# Altium schematic sheet OneKey_Download.SchDoc
size A4
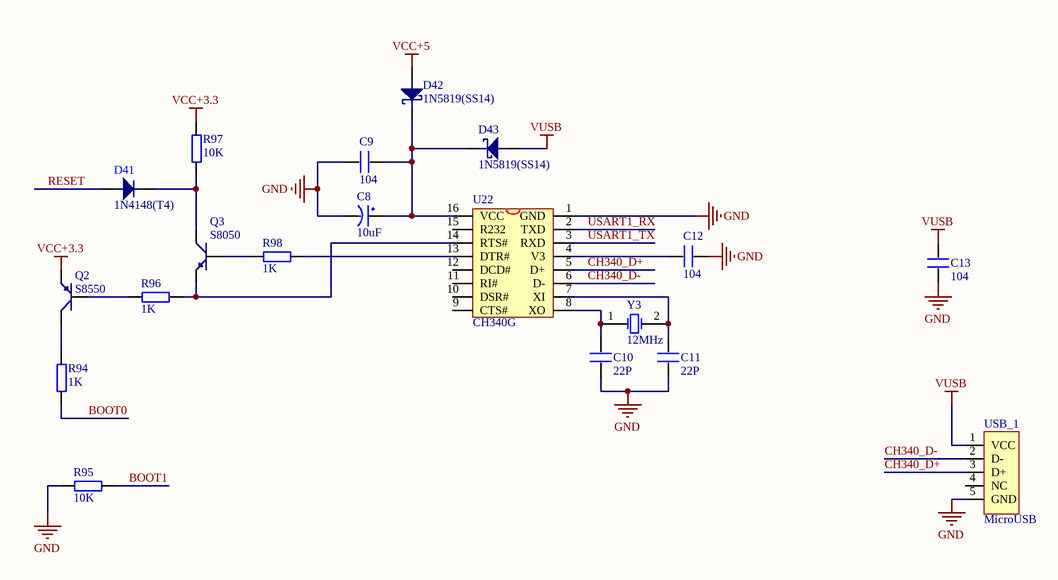
[diagram p0: OneKey_Download.SchDoc]

## Parts
C8  10uF  [CAP2.54]
C9  104  [0805-CAP]
C10  22P  [0805-CAP]
C11  22P  [0805-CAP]
C12  104  [0805-CAP]
C13  104  [0805-CAP]
D41  1N4148(T4)  [SOD-123]
D42  1N5819(SS14)  [DO-214AC(SMA)]
D43  1N5819(SS14)  [DO-214AC(SMA)]
Q2  S8550  [SOT-23R]
Q3  S8050  [SOT-23R]
R94  1K  [0805-RES]
R95  10K  [0805-RES]
R96  1K  [0805-RES]
R97  10K  [0805-RES]
R98  1K  [0805-RES]
U22  CH340G  [SOP16M]
USB_1  MicroUSB  [USB_micro]
Y3  12MHz  [XTAL_US]

## Nets
GND: C8.2(GND) C9.1 C10.1 C11.1 C12.2 C13.1 R95.1 U22.1(GND) USB_1.5(GND)
VCC+3.3: Q2.1(E) R97.2
VCC+5: D42.1
VUSB: C13.2 D43.1 USB_1.1(VCC)
BOOT0: R94.1
BOOT1: R95.2
CH340_D+: U22.5(D+) USB_1.3(D+)
CH340_D-: U22.6(D-) USB_1.2(D-)
RESET: D41.1
USART1_RX: U22.2(TXD)
USART1_TX: U22.3(RXD)
NetC8_1: C8.1(VCC) C9.2 D42.2 D43.2 U22.16(VCC)
NetC10_2: C10.2 U22.8(XO) Y3.1(OSC1)
NetC11_2: C11.2 U22.7(XI) Y3.2(OSC2)
NetC12_1: C12.1 U22.4(V3)
NetD41_2: D41.2 Q3.3(C) R97.1
NetQ2_2: Q2.2(B) R96.1
NetQ2_3: Q2.3(C) R94.2
NetQ3_1: Q3.1(E) R96.2 U22.14(RTS#)
NetQ3_2: Q3.2(B) R98.1
NetR98_2: R98.2 U22.13(DTR#)

Not connected (* = marked no-connect by the designer): U22 9(CTS#) 10(DSR#) 11(RI#) 12(DCD#) 15(R232); USB_1 4(NC)

## Library data of the parts
C8 = CAP
C9-C13 = C
D41 = 1N4148: 高速开关二极管
D42 D43 = 1N5819(SS14): 肖特基二极管
Q2 = PNP: 8550/BCW68
Q3 = NPN: 8050/BCW846/BCW847
R94-R98 = Res
U22 = CH340G: USB2UART
USB_1 = USB5
Y3 = XTAL: Crystal Oscillator; Published: 8-Jun-2000; LatestRevisionDate: 17-Jul-2002; LatestRevisionNote: Re-released for DXP Platform.; Publisher: Altium Limited